# Altium schematic sheet MPR.SchDoc: MPR MicroPressure Schematic
size A4; SheetNumber: 2; SheetTotal: 8
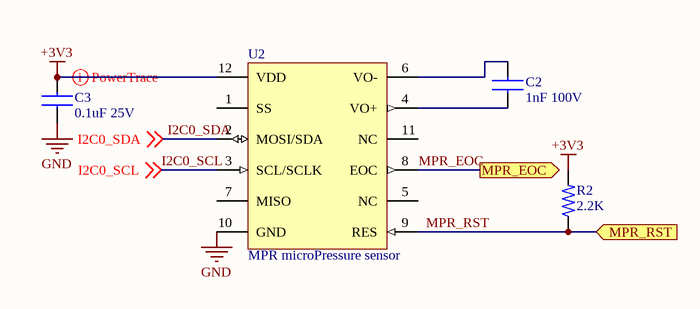
[diagram p0: MPR.SchDoc]

## Parts
C2  1nF 100V  [Chip2Pin_1.6x0.8x0.9_CAP]
C3  0.1uF 25V  [Chip2Pin_1.6x0.8x0.9_CAP]
R2  2.2K  [RES_0603_1608X06]
U2  MPR microPressure sensor  [12-MANUAL-5x5]

## Ports
MPR_EOC (out, see EFR32BG13_IO_Port_Pins[1B]), MPR_RST (in, see EFR32BG13_IO_Port_Pins[1C])

## Nets
+3V3: C3.1 R2.2 U2.12(VDD)
GND: C3.2 U2.10(GND)
I2C0_SCL: U2.3(SCL/SCLK) ; off-sheet I2C0_SCL
I2C0_SDA: U2.2(MOSI/SDA) ; off-sheet I2C0_SDA
MPR_EOC: U2.8(EOC) ; port MPR_EOC
MPR_RST: R2.1 U2.9(RES) ; port MPR_RST
NetC2_1: C2.1 U2.6(VO-)
NetC2_2: C2.2 U2.4(VO+)

Not connected (* = marked no-connect by the designer): U2 1(SS) 5(NC) 7(MISO) 11(NC)

## Layout directives
rule Width Constraint [Pref Width = 20mil    Min Width = 10mil    Max Width = 20mil]: +3V3

## Library data of the parts
C2 = GRM188R72A102KA01D: 0603 1 nF 100V ±10% Tol. X7R Surface Mount Multilayer Ceramic Capacitor; Manufacturer: Murata; Supplier 1: Arrow Electronics; Manufacturer Part Number: GRM188R72A102KA01D; RoHS: Yes; Category: Ceramic Capacitors; Stock 1: 100000; Pricing 1: 4000=0.08590, 8000=0.08510, 48000=0.01650, 100000=0.01630 (USD); Mounting Technology: Surface Mount; Case/Package: 0603; Pins: 2; Case Code (Metric): 1608; Case Code (Imperial): 0603; Material: Ceramic; Min Operating Temperature: -55°C; Max Operating Temperature: 125°C; Tolerance: 10%; Value: 1nF; Dielectric: X7R; Packaging: Tape and Reel; Package Quantity: 1; Termination: SMD/SMT; Series: GRM; Voltage Rating: 100V; Voltage Rating (DC): 100V; Voltage: 100V; Construction: Flat; Length: 1.6mm; Width: 0.031inch; Height: 0.8mm; Depth: 0.8mm; Thickness: 0.035inch; Size: 0.8mm; Radiation Hardening: No; Lead Free: Lead Free; Reach SVHC Compliant: Yes; RoHS Compliant: Yes; ComponentLink1URL: https://datasheet.ciiva.com/19476/1857807-19476162.pdf?src-supplier=Jameco; ComponentLink1Description: https://datasheet.ciiva.com/19476/1857807-19476162.pdf?src-supplier=Jameco; ComponentLink2URL: https://datasheet.ciiva.com/18101/getdatasheetpartid-44736-18101395.pdf?src-supplier=Verical; ComponentLink2Description: https://datasheet.ciiva.com/18101/getdatasheetpartid-44736-18101395.pdf?src-supplier=Verical; ComponentLink3URL: https://datasheet.ciiva.com/11789/0900766b80ef921d-11789065.pdf?src-supplier=Rs; ComponentLink3Description: https://datasheet.ciiva.com/11789/0900766b80ef921d-11789065.pdf?src-supplier=Rs; ComponentLink4URL: https://datasheet.ciiva.com/29201/451956-da-01-en-vs-kondensator-0603-29201706.pdf?src-supplier=Conrad; ComponentLink4Description: https://datasheet.ciiva.com/29201/451956-da-01-en-vs-kondensator-0603-29201706.pdf?src-supplier=Conrad; ComponentLink5URL: https://datasheet.ciiva.com/7937/608985-7937675.pdf?src-supplier=Element14; ComponentLink5Description: https://datasheet.ciiva.com/7937/608985-7937675.pdf?src-supplier=Element14; ComponentLink6URL: https://datasheet.ciiva.com/131/partnumbering-e-01-131946.pdf?src-supplier=Digi-Key; ComponentLink6Description: https://datasheet.ciiva.com/131/partnumbering-e-01-131946.pdf?src-supplier=Digi-Key; ComponentLink7URL: https://datasheet.ciiva.com/131/partnumbering-e-01-131945.pdf?src-supplier=Digi-Key; ComponentLink7Description: https://datasheet.ciiva.com/131/partnumbering-e-01-131945.pdf?src-supplier=Digi-Key; ComponentLink8URL: https://datasheet.ciiva.com/131/partnumbering-e-01-131947.pdf?src-supplier=Digi-Key; ComponentLink8Description: https://datasheet.ciiva.com/131/partnumbering-e-01-131947.pdf?src-supplier=Digi-Key
C3 = GCJ188R71E104KA12D: Cap Ceramic 0.1uF 25V X7R 10% Pad SMD 0603 Soft Termination 125C Automotive T/R; Manufacturer: Murata; Value: 100nF; Supplier 1: Arrow Electronics; Manufacturer Part Number: GCJ188R71E104KA12D; RoHS: Yes; Category: Ceramic Capacitors; Stock 1: 11360; Pricing 1: 1=0.14710, 10=0.11710, 25=0.11140, 100=0.11030, 250=0.10920, 500=0.10810, 1000=0.10700, 3000=0.10600, 6000=0.10490 (USD); Mounting Technology: Surface Mount; Case/Package: 0603; Case Code (Imperial): 0603; Case Code (Metric): 1608; Min Operating Temperature: -55°C; Max Operating Temperature: 125°C; Features: Soft Termination; Packaging: Tape and Reel; Tolerance: 10%; Voltage Rating: 25V; Ratings: AEC-Q200; RoHS Compliant: Yes; ComponentLink1URL: http://search.murata.co.jp/Ceramy/image/img/A01X/G101/ENG/GCJ188R71E104KA12-01.pdf?src-supplier=Digi-Key; ComponentLink1Description: http://search.murata.co.jp/Ceramy/image/img/A01X/G101/ENG/GCJ188R71E104KA12-01.pdf?src-supplier=Digi-Key
R2 = RC0603FR-072K2L: Res Thick Film 0603 2.2K Ohm 1% 0.1W(1/10W) ±100ppm/°C Pad SMD T/R; Manufacturer: Yageo; Value: 2.2kR; Power Rating: 100mW; Voltage Rating: 50V; Supplier 1: Future Electronics; Manufacturer Part Number: RC0603FR-072K2L; RoHS: Yes; Category: Chip SMD Resistors; Stock 1: 1981; Pricing 1: 1=0.10000, 20=0.06610, 100=0.04800, 500=0.02980, 2500=0.01160 (USD); Case/Package: 0603; Case Code (Imperial): 0603; Case Code (Metric): 1608; Min Operating Temperature: -55°C; Max Operating Temperature: 155°C; Tolerance: 1%; Packaging: Tape and Reel; Package Quantity: 1; Termination: SMD/SMT; Resistor Type: Thick Film; Number of Terminations: 2; Temperature Coefficient: 100ppm/°C; Max Power Dissipation: 100mW; Features: Moisture Resistant; Series: RC; Resistance Tolerance: 1%; Construction: Rectangular; Length: 1.6mm; Width: 0.031inch; Height: 0.022inch; Depth: 0.8mm; Lead Free: Lead Free; RoHS Compliant: Yes; Military Standard: Not; ComponentLink1URL: https://datasheet.ciiva.com/2453/pyu-r-int-thick-7-2453943.pdf?src-supplier=Digi-Key; ComponentLink1Description: https://datasheet.ciiva.com/2453/pyu-r-int-thick-7-2453943.pdf?src-supplier=Digi-Key; ComponentLink2URL: https://datasheet.ciiva.com/2453/pyu-r-int-thick-7-2453944.pdf?src-supplier=Digi-Key; ComponentLink2Description: https://datasheet.ciiva.com/2453/pyu-r-int-thick-7-2453944.pdf?src-supplier=Digi-Key; ComponentLink3URL: https://datasheet.ciiva.com/2453/pyu-r-int-thick-7-2453945.pdf?src-supplier=Digi-Key; ComponentLink3Description: https://datasheet.ciiva.com/2453/pyu-r-int-thick-7-2453945.pdf?src-supplier=Digi-Key; ComponentLink4URL: https://datasheet.ciiva.com/7660/1868787-7660791.pdf?src-supplier=Element14; ComponentLink4Description: https://datasheet.ciiva.com/7660/1868787-7660791.pdf?src-supplier=Element14; ComponentLink5URL: https://datasheet.ciiva.com/46394/443971-46394958.pdf?src-supplier=Element14; ComponentLink5Description: https://datasheet.ciiva.com/46394/443971-46394958.pdf?src-supplier=Element14; ComponentLink6URL: https://datasheet.ciiva.com/46440/1868787-46440902.pdf?src-supplier=Element14; ComponentLink6Description: https://datasheet.ciiva.com/46440/1868787-46440902.pdf?src-supplier=Element14
U2 = MPRLS0025PA00001A: Board Mount Pressure Sensor 0psi to 25psi Absolute 12-Pin T/R; Manufacturer: Honeywell; Nominal Supply Current: 1.7mA; Accuracy: 0.25%; Supplier 1: Arrow Electronics; Manufacturer Part Number: MPRLS0025PA00001A; RoHS: Yes; Category: Pressure Sensors; Stock 1: 160; Pricing 1: 160=7.35000, 4000=7.30500 (USD); Case/Package: SMD/SMT; Min Operating Temperature: -40°C; Max Operating Temperature: 85°C; RoHS Compliant: Yes; ComponentLink1URL: http://www.farnell.com/datasheets/2548296.pdf?src-supplier=Farnell; ComponentLink1Description: http://www.farnell.com/datasheets/2548296.pdf?src-supplier=Farnell; ComponentLink2URL: https://sensing.honeywell.com/honeywell-sensing-micropressure-board-mount-pressure-mpr-series-datasheet-32332628-d-en.pdf?src-supplier=Digi-Key; ComponentLink2Description: https://sensing.honeywell.com/honeywell-sensing-micropressure-board-mount-pressure-mpr-series-datasheet-32332628-d-en.pdf?src-supplier=Digi-Key; ComponentLink3URL: http://www.farnell.com/datasheets/2548296.pdf?src-supplier=Newark; ComponentLink3Description: http://www.farnell.com/datasheets/2548296.pdf?src-supplier=Newark